# EAGLE schematic smartcar_shield (EAGLE 7.2.0)
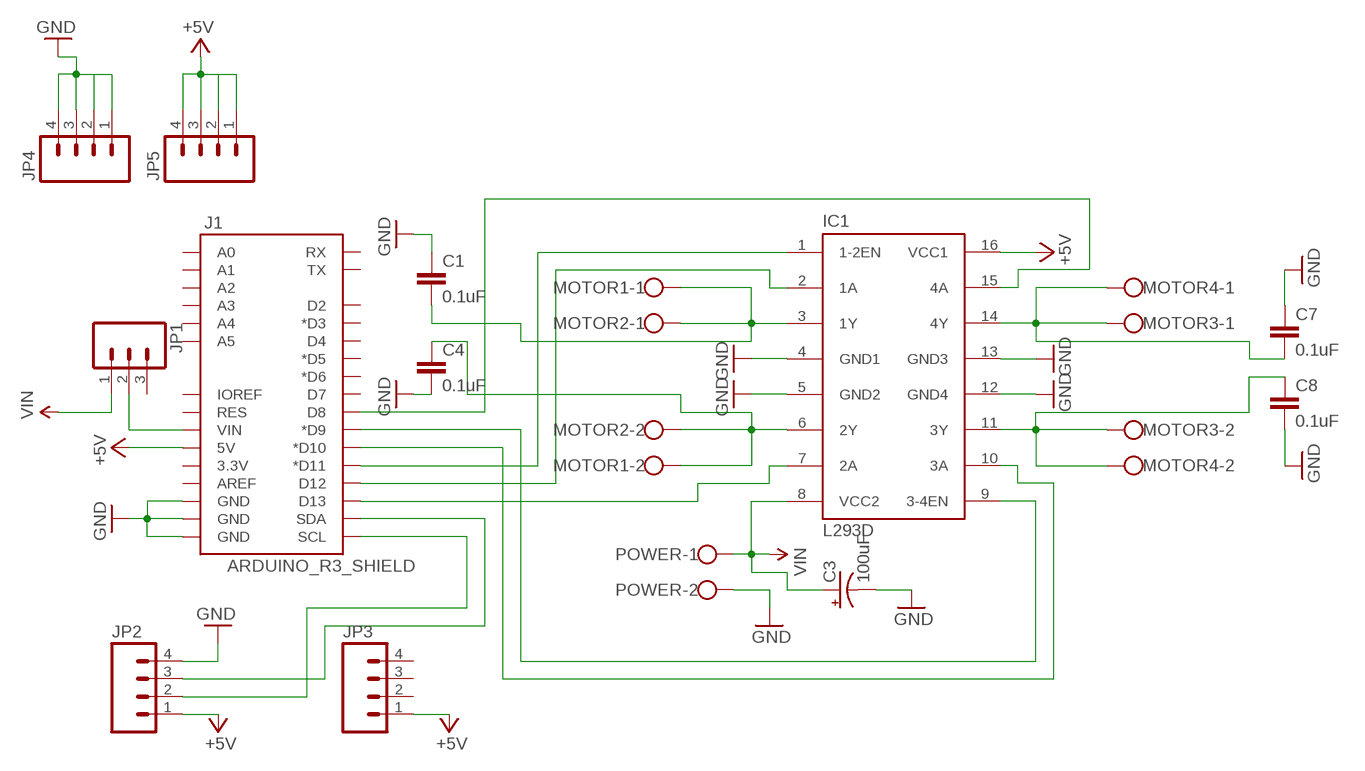
[diagram p0: schematic, sheet 1]

## Parts
C1  0.1uF  CAPKIT  [CAP-PTH-SMALL-KIT]
C3  100uF  CAP_POLPTH2  [CPOL-RADIAL-10UF-25V]
C4  0.1uF  CAPKIT  [CAP-PTH-SMALL-KIT]
C7  0.1uF  CAPKIT  [CAP-PTH-SMALL-KIT]
C8  0.1uF  CAPKIT  [CAP-PTH-SMALL-KIT]
IC1  L293D  [DIL16]
J1  ARDUINO_R3_SHIELD  [UNO_R3_SHIELD]
JP1  M03PTH  [1X03]
JP2  M04NO_SILK_ALL_ROUND  [1X04_NO_SILK_ALL_ROUND]
JP3  M04NO_SILK_ALL_ROUND  [1X04_NO_SILK_ALL_ROUND]
JP4  M04NO_SILK_ALL_ROUND  [1X04_NO_SILK_ALL_ROUND]
JP5  M04NO_SILK_ALL_ROUND  [1X04_NO_SILK_ALL_ROUND]
MOTOR1  W237-102  [W237-102]
MOTOR2  W237-102  [W237-102]
MOTOR3  W237-102  [W237-102]
MOTOR4  W237-102  [W237-102]
POWER  W237-102  [W237-102]

## Nets
12V: C3.1(+) IC1.8(VCC2) JP1.1 POWER.1 ; supply symbol labelled VIN
+5V: IC1.16(VCC1) J1.5V JP2.1 JP3.1 JP5.1 JP5.2 JP5.3 JP5.4
ENABLE1: IC1.1(1-2EN) J1.D11(*D11)
ENABLE2: IC1.9(3-4EN) J1.D9(*D9)
GND: C1.1 C3.2(-) C4.2 C7.1 C8.2 IC1.4(GND1) IC1.5(GND2) IC1.12(GND4) IC1.13(GND3) J1.GND@0(GND) J1.GND@1(GND) J1.GND@2(GND) JP2.4 JP4.1 JP4.2 JP4.3 JP4.4 POWER.2
MOTORA-1: IC1.2(1A) J1.D12
MOTORA-2: IC1.7(2A) J1.D13
MOTORA-OUT1: C1.2 IC1.3(1Y) MOTOR1.1 MOTOR2.1
MOTORA-OUT2: C4.1 IC1.6(2Y) MOTOR1.2 MOTOR2.2
MOTORB-1: IC1.15(4A) J1.D8
MOTORB-2: IC1.10(3A) J1.D10(*D10)
MOTORB-OUT1: C7.2 IC1.14(4Y) MOTOR3.1 MOTOR4.1
MOTORB-OUT2: C8.1 IC1.11(3Y) MOTOR3.2 MOTOR4.2
N$2: J1.SDA JP2.3
SCL: J1.SCL JP2.2
VIN: J1.VIN JP1.2
Unconnected: J1.3.3V J1.A0 J1.A1 J1.A2 J1.A3 J1.A4 J1.A5 J1.AREF J1.D2 J1.D3(*D3) J1.D4 J1.D5(*D5) J1.D6(*D6) J1.D7 J1.IOREF J1.RES J1.RX J1.TX JP1.3 JP3.2 JP3.3 JP3.4

## Library data of the parts
C1 C4 C7 C8 = SparkFun-Capacitors:CAP: Capacitor Standard 0603 ceramic capacitor, and 0.1" leaded capacitor.
C3 = SparkFun-Capacitors:CAP_POL: Capacitor Polarized These are standard SMD and PTH capacitors. Normally 10uF, 47uF, and 100uF in electrolytic and tantalum varieties. Always verify the external diameter of the through hole cap, it varies with capacity, voltage, and manufacturer. The EIA devices should be standard.
IC1 = st-microelectronics:L293D: PUSH-PULL 4 CHANNEL DRIVER; MPN: L293D; OC_FARNELL: 9589619; OC_NEWARK: 56P8249
J1 = SparkFun-Boards:ARDUINO_R3_SHIELD: Shield form compatible with the Arduino Uno R3.
JP1 = SparkFun-Connectors:M03: Header 3 Standard 3-pin 0.1" header. Use with straight break away headers (SKU : PRT-00116), right angle break away headers (PRT-00553), swiss pins (PRT-00743), machine pins (PRT-00117), and female headers (PRT-00115). Molex polarized connector foot print use with SKU : PRT-08232 with associated crimp pins and housings.
JP2-JP5 = SparkFun-Connectors:M04: Header 4 Standard 4-pin 0.1" header. Use with straight break away headers (SKU : PRT-00116), right angle break away headers (PRT-00553), swiss pins (PRT-00743), machine pins (PRT-00117), and female headers (PRT-00115). Molex polarized connector foot print use with SKU : PRT-08231 with associated crimp pins and housings. 1MM SMD Version SKU: PRT-10208
MOTOR1-MOTOR4 POWER = con-wago-500:W237-102: WAGO SCREW CLAMP; MPN: 237-102; OC_FARNELL: unknown; OC_NEWARK: 70K9898

## Net classes
0 default: width 0.152 mm, drill 0.305 mm, clearance 0.152 mm